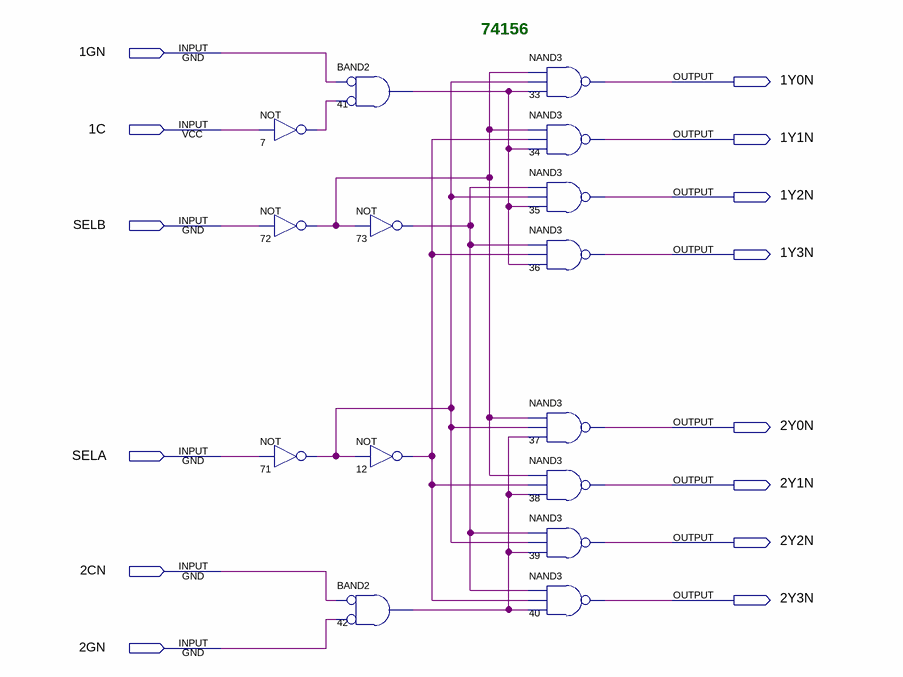
[diagram p0: schematic sheet]
// Quartus schematic 74156.bdf as structural Verilog: 15 symbols, 14 pins
module \74156  (
  input  \1GN ,
  input  \1C ,
  input  SELB,
  input  SELA,
  input  \2CN ,
  input  \2GN ,
  output \1Y0N ,
  output \1Y1N ,
  output \1Y2N ,
  output \1Y3N ,
  output \2Y0N ,
  output \2Y1N ,
  output \2Y2N ,
  output \2Y3N 
);

  wire n7_out, n12_out, n41_out, n42_out, n71_out, n72_out, n73_out;

  not u_7 (n7_out, \1C );
  not u_72 (n72_out, SELB);
  not u_71 (n71_out, SELA);
  and u_41 (n41_out, ~\1GN , ~n7_out);  // BAND2
  and u_42 (n42_out, ~\2CN , ~\2GN );  // BAND2
  not u_73 (n73_out, n72_out);
  not u_12 (n12_out, n71_out);
  nand u_33 (\1Y0N , n72_out, n71_out, n41_out);
  nand u_34 (\1Y1N , n72_out, n12_out, n41_out);
  nand u_35 (\1Y2N , n73_out, n71_out, n41_out);
  nand u_36 (\1Y3N , n73_out, n12_out, n41_out);
  nand u_37 (\2Y0N , n72_out, n71_out, n42_out);
  nand u_38 (\2Y1N , n72_out, n12_out, n42_out);
  nand u_39 (\2Y2N , n73_out, n71_out, n42_out);
  nand u_40 (\2Y3N , n73_out, n12_out, n42_out);

  // Notes on the sheet:
  //   74156
endmodule
